# Altium project KeyPad_84_L.PrjPcb
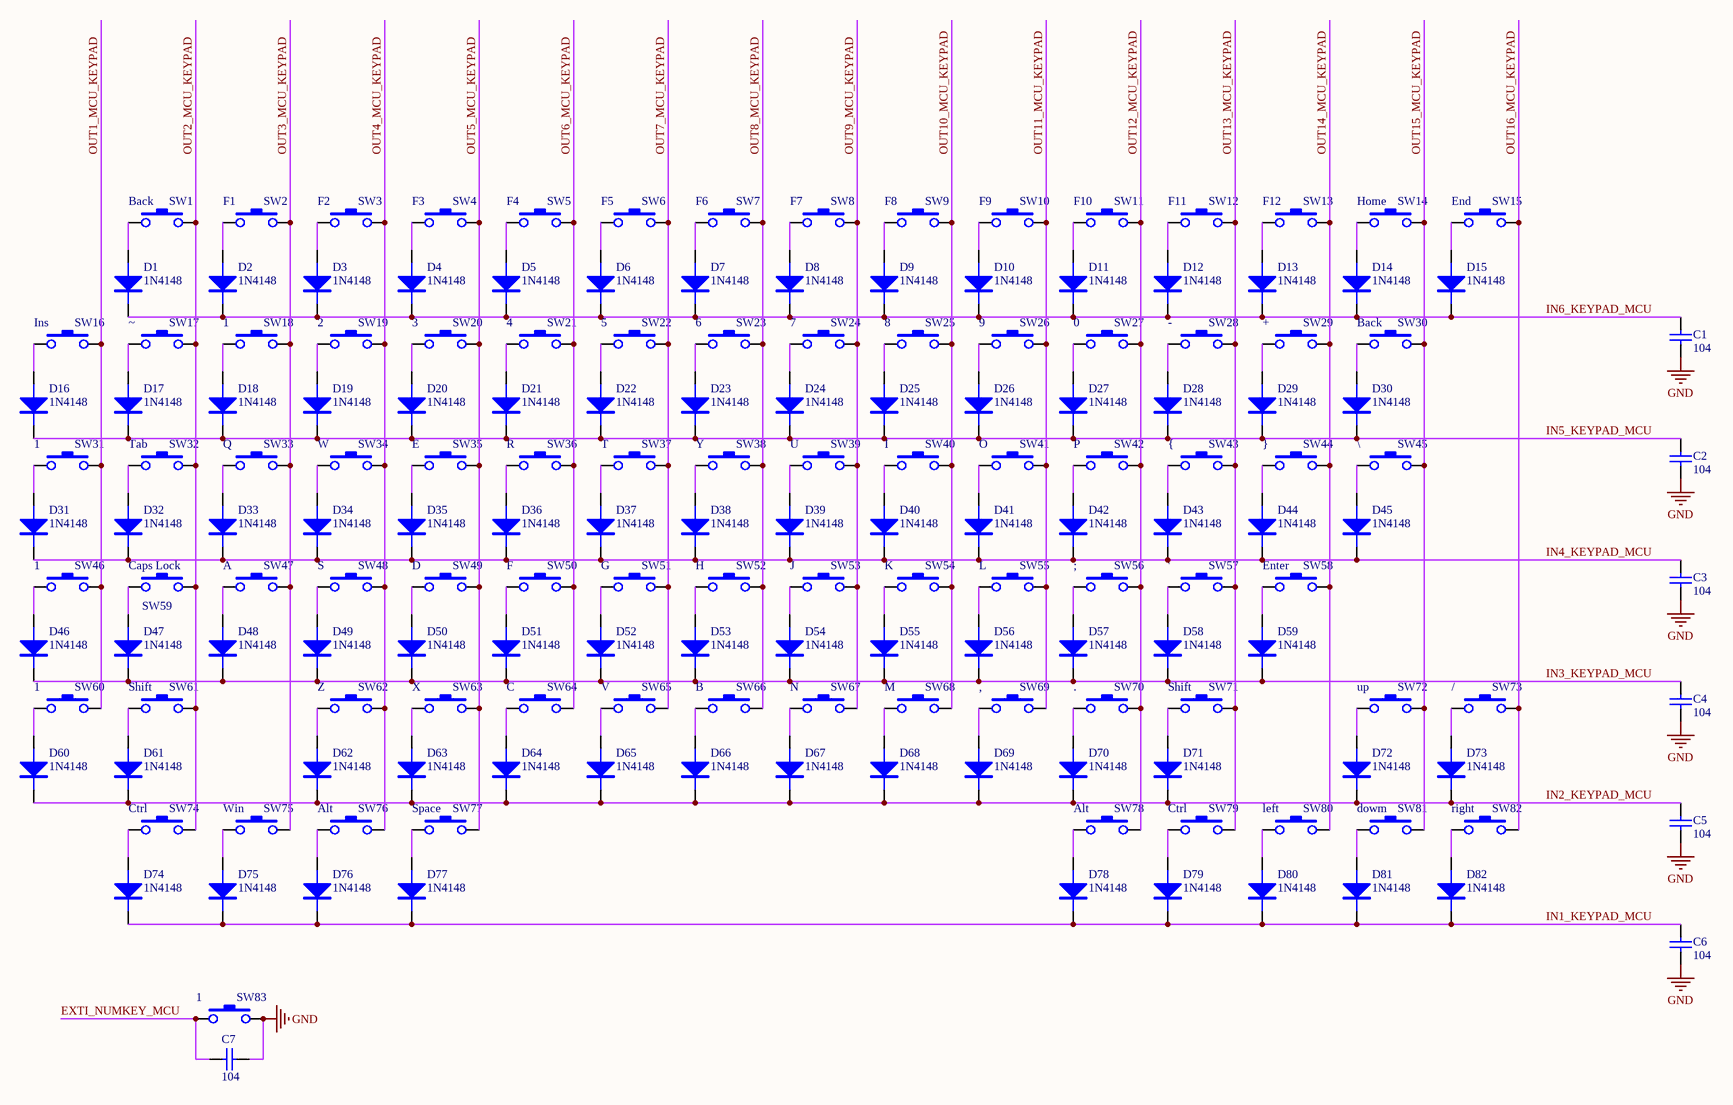
[diagram p0: KEY_Pad.SchDoc]
5 sheets, 237 parts. Net scope: global (net labels, ports and power ports of the same name join across sheets).
Board file: Keyboard_84.PcbDoc
Sheets:
  KEY_Pad.SchDoc
  POWER.SchDoc
  LED.SchDoc
  NRF24L01.SchDoc
  MCU.SchDoc

## Sheet KEY_Pad.SchDoc
size A3

### Parts
C1  104  [Cap-0603]
C2  104  [Cap-0603]
C3  104  [Cap-0603]
C4  104  [Cap-0603]
C5  104  [Cap-0603]
C6  104  [Cap-0603]
C7  104  [Cap-0603]
D1  1N4148  [SOD-523]
D2  1N4148  [SOD-523]
D3  1N4148  [SOD-523]
D4  1N4148  [SOD-523]
D5  1N4148  [SOD-523]
D6  1N4148  [SOD-523]
D7  1N4148  [SOD-523]
D8  1N4148  [SOD-523]
D9  1N4148  [SOD-523]
D10  1N4148  [SOD-523]
D11  1N4148  [SOD-523]
D12  1N4148  [SOD-523]
D13  1N4148  [SOD-523]
D14  1N4148  [SOD-523]
D15  1N4148  [SOD-523]
D16  1N4148  [SOD-523]
D17  1N4148  [SOD-523]
D18  1N4148  [SOD-523]
D19  1N4148  [SOD-523]
D20  1N4148  [SOD-523]
D21  1N4148  [SOD-523]
D22  1N4148  [SOD-523]
D23  1N4148  [SOD-523]
D24  1N4148  [SOD-523]
D25  1N4148  [SOD-523]
D26  1N4148  [SOD-523]
D27  1N4148  [SOD-523]
D28  1N4148  [SOD-523]
D29  1N4148  [SOD-523]
D30  1N4148  [SOD-523]
D31  1N4148  [SOD-523]
D32  1N4148  [SOD-523]
D33  1N4148  [SOD-523]
D34  1N4148  [SOD-523]
D35  1N4148  [SOD-523]
D36  1N4148  [SOD-523]
D37  1N4148  [SOD-523]
D38  1N4148  [SOD-523]
D39  1N4148  [SOD-523]
D40  1N4148  [SOD-523]
D41  1N4148  [SOD-523]
D42  1N4148  [SOD-523]
D43  1N4148  [SOD-523]
D44  1N4148  [SOD-523]
D45  1N4148  [SOD-523]
D46  1N4148  [SOD-523]
D47  1N4148  [SOD-523]
D48  1N4148  [SOD-523]
D49  1N4148  [SOD-523]
D50  1N4148  [SOD-523]
D51  1N4148  [SOD-523]
D52  1N4148  [SOD-523]
D53  1N4148  [SOD-523]
D54  1N4148  [SOD-523]
D55  1N4148  [SOD-523]
D56  1N4148  [SOD-523]
D57  1N4148  [SOD-523]
D58  1N4148  [SOD-523]
D59  1N4148  [SOD-523]
D60  1N4148  [SOD-523]
D61  1N4148  [SOD-523]
D62  1N4148  [SOD-523]
D63  1N4148  [SOD-523]
D64  1N4148  [SOD-523]
D65  1N4148  [SOD-523]
D66  1N4148  [SOD-523]
D67  1N4148  [SOD-523]
D68  1N4148  [SOD-523]
D69  1N4148  [SOD-523]
D70  1N4148  [SOD-523]
D71  1N4148  [SOD-523]
D72  1N4148  [SOD-523]
D73  1N4148  [SOD-523]
D74  1N4148  [SOD-523]
D75  1N4148  [SOD-523]
D76  1N4148  [SOD-523]
D77  1N4148  [SOD-523]
D78  1N4148  [SOD-523]
D79  1N4148  [SOD-523]
D80  1N4148  [SOD-523]
D81  1N4148  [SOD-523]
D82  1N4148  [SOD-523]
SW1  Back  [MX_SW-4]
SW2  F1  [MX_SW-4]
SW3  F2  [MX_SW-4]
SW4  F3  [MX_SW-4]
SW5  F4  [MX_SW-4]
SW6  F5  [MX_SW-4]
SW7  F6  [MX_SW-4]
SW8  F7  [MX_SW-4]
SW9  F8  [MX_SW-4]
SW10  F9  [MX_SW-4]
SW11  F10  [MX_SW-4]
SW12  F11  [MX_SW-4]
SW13  F12  [MX_SW-4]
SW14  Home  [MX_SW-4]
SW15  End  [MX_SW-4]
SW16  Ins  [MX_SW-4]
SW17  ~  [MX_SW-4]
SW18  1  [MX_SW-4]
SW19  2  [MX_SW-4]
SW20  3  [MX_SW-4]
SW21  4  [MX_SW-4]
SW22  5  [MX_SW-4]
SW23  6  [MX_SW-4]
SW24  7  [MX_SW-4]
SW25  8  [MX_SW-4]
SW26  9  [MX_SW-4]
SW27  0  [MX_SW-4]
SW28  -  [MX_SW-4]
SW29  +  [MX_SW-4]
SW30  Back  [MX_SW-4]
SW31  1  [MX_SW-4]
SW32  Tab  [MX_SW-4]
SW33  Q  [MX_SW-4]
SW34  W  [MX_SW-4]
SW35  E  [MX_SW-4]
SW36  R  [MX_SW-4]
SW37  T  [MX_SW-4]
SW38  Y  [MX_SW-4]
SW39  U  [MX_SW-4]
SW40  I  [MX_SW-4]
SW41  O  [MX_SW-4]
SW42  P  [MX_SW-4]
SW43  {  [MX_SW-4]
SW44  }  [MX_SW-4]
SW45  \  [MX_SW-4]
SW46  1  [MX_SW-4]
SW47  A  [MX_SW-4]
SW48  S  [MX_SW-4]
SW49  D  [MX_SW-4]
SW50  F  [MX_SW-4]
SW51  G  [MX_SW-4]
SW52  H  [MX_SW-4]
SW53  J  [MX_SW-4]
SW54  K  [MX_SW-4]
SW55  L  [MX_SW-4]
SW56  ;  [MX_SW-4]
SW57  '  [MX_SW-4]
SW58  Enter  [MX_SW-4]
SW59  Caps Lock  [MX_SW-4]
SW60  1  [MX_SW-4]
SW61  Shift  [MX_SW-4]
SW62  Z  [MX_SW-4]
SW63  X  [MX_SW-4]
SW64  C  [MX_SW-4]
SW65  V  [MX_SW-4]
SW66  B  [MX_SW-4]
SW67  N  [MX_SW-4]
SW68  M  [MX_SW-4]
SW69  ,  [MX_SW-4]
SW70  .  [MX_SW-4]
SW71  Shift  [MX_SW-4]
SW72  up  [MX_SW-4]
SW73  /  [MX_SW-4]
SW74  Ctrl  [MX_SW-4]
SW75  Win  [MX_SW-4]
SW76  Alt  [MX_SW-4]
SW77  Space  [MX_SW-4]
SW78  Alt  [MX_SW-4]
SW79  Ctrl  [MX_SW-4]
SW80  left  [MX_SW-4]
SW81  dowm  [MX_SW-4]
SW82  right  [MX_SW-4]
SW83  1  [MX_SW-4]

### Nets
GND: C1.2 C2.2 C3.2 C4.2 C5.2 C6.2 C7.2 SW83.2
EXTI_NUMKEY_MCU: C7.1 SW83.1
IN1_KEYPAD_MCU: C6.1 D74.K D75.K D76.K D77.K D78.K D79.K D80.K D81.K D82.K
IN2_KEYPAD_MCU: C5.1 D60.K D61.K D62.K D63.K D64.K D65.K D66.K D67.K D68.K D69.K D70.K D71.K D72.K D73.K
IN3_KEYPAD_MCU: C4.1 D46.K D47.K D48.K D49.K D50.K D51.K D52.K D53.K D54.K D55.K D56.K D57.K D58.K D59.K
IN4_KEYPAD_MCU: C3.1 D31.K D32.K D33.K D34.K D35.K D36.K D37.K D38.K D39.K D40.K D41.K D42.K D43.K D44.K D45.K
IN5_KEYPAD_MCU: C2.1 D16.K D17.K D18.K D19.K D20.K D21.K D22.K D23.K D24.K D25.K D26.K D27.K D28.K D29.K D30.K
IN6_KEYPAD_MCU: C1.1 D1.K D2.K D3.K D4.K D5.K D6.K D7.K D8.K D9.K D10.K D11.K D12.K D13.K D14.K D15.K
OUT1_MCU_KEYPAD: SW16.2 SW31.2 SW46.2 SW60.2
OUT2_MCU_KEYPAD: SW1.2 SW17.2 SW32.2 SW59.2 SW61.2 SW74.2
OUT3_MCU_KEYPAD: SW2.2 SW18.2 SW33.2 SW47.2 SW75.2
OUT4_MCU_KEYPAD: SW3.2 SW19.2 SW34.2 SW48.2 SW62.2 SW76.2
OUT5_MCU_KEYPAD: SW4.2 SW20.2 SW35.2 SW49.2 SW63.2 SW77.2
OUT6_MCU_KEYPAD: SW5.2 SW21.2 SW36.2 SW50.2 SW64.2
OUT7_MCU_KEYPAD: SW6.2 SW22.2 SW37.2 SW51.2 SW65.2
OUT8_MCU_KEYPAD: SW7.2 SW23.2 SW38.2 SW52.2 SW66.2
OUT9_MCU_KEYPAD: SW8.2 SW24.2 SW39.2 SW53.2 SW67.2
OUT10_MCU_KEYPAD: SW9.2 SW25.2 SW40.2 SW54.2 SW68.2
OUT11_MCU_KEYPAD: SW10.2 SW26.2 SW41.2 SW55.2 SW69.2
OUT12_MCU_KEYPAD: SW11.2 SW27.2 SW42.2 SW56.2 SW70.2 SW78.2
OUT13_MCU_KEYPAD: SW12.2 SW28.2 SW43.2 SW57.2 SW71.2 SW79.2
OUT14_MCU_KEYPAD: SW13.2 SW29.2 SW44.2 SW58.2 SW80.2
OUT15_MCU_KEYPAD: SW14.2 SW30.2 SW45.2 SW72.2 SW81.2
OUT16_MCU_KEYPAD: SW15.2 SW73.2 SW82.2
NetD1_A: D1.A SW1.1
NetD2_A: D2.A SW2.1
NetD3_A: D3.A SW3.1
NetD4_A: D4.A SW4.1
NetD5_A: D5.A SW5.1
NetD6_A: D6.A SW6.1
NetD7_A: D7.A SW7.1
NetD8_A: D8.A SW8.1
NetD9_A: D9.A SW9.1
NetD10_A: D10.A SW10.1
NetD11_A: D11.A SW11.1
NetD12_A: D12.A SW12.1
NetD13_A: D13.A SW13.1
NetD14_A: D14.A SW14.1
NetD15_A: D15.A SW15.1
NetD16_A: D16.A SW16.1
NetD17_A: D17.A SW17.1
NetD18_A: D18.A SW18.1
NetD19_A: D19.A SW19.1
NetD20_A: D20.A SW20.1
NetD21_A: D21.A SW21.1
NetD22_A: D22.A SW22.1
NetD23_A: D23.A SW23.1
NetD24_A: D24.A SW24.1
NetD25_A: D25.A SW25.1
NetD26_A: D26.A SW26.1
NetD27_A: D27.A SW27.1
NetD28_A: D28.A SW28.1
NetD29_A: D29.A SW29.1
NetD30_A: D30.A SW30.1
NetD31_A: D31.A SW31.1
NetD32_A: D32.A SW32.1
NetD33_A: D33.A SW33.1
NetD34_A: D34.A SW34.1
NetD35_A: D35.A SW35.1
NetD36_A: D36.A SW36.1
NetD37_A: D37.A SW37.1
NetD38_A: D38.A SW38.1
NetD39_A: D39.A SW39.1
NetD40_A: D40.A SW40.1
NetD41_A: D41.A SW41.1
NetD42_A: D42.A SW42.1
NetD43_A: D43.A SW43.1
NetD44_A: D44.A SW44.1
NetD45_A: D45.A SW45.1
NetD46_A: D46.A SW46.1
NetD47_A: D47.A SW59.1
NetD48_A: D48.A SW47.1
NetD49_A: D49.A SW48.1
NetD50_A: D50.A SW49.1
NetD51_A: D51.A SW50.1
NetD52_A: D52.A SW51.1
NetD53_A: D53.A SW52.1
NetD54_A: D54.A SW53.1
NetD55_A: D55.A SW54.1
NetD56_A: D56.A SW55.1
NetD57_A: D57.A SW56.1
NetD58_A: D58.A SW57.1
NetD59_A: D59.A SW58.1
NetD60_A: D60.A SW60.1
NetD61_A: D61.A SW61.1
NetD62_A: D62.A SW62.1
NetD63_A: D63.A SW63.1
NetD64_A: D64.A SW64.1
NetD65_A: D65.A SW65.1
NetD66_A: D66.A SW66.1
NetD67_A: D67.A SW67.1
NetD68_A: D68.A SW68.1
NetD69_A: D69.A SW69.1
NetD70_A: D70.A SW70.1
NetD71_A: D71.A SW71.1
NetD72_A: D72.A SW72.1
NetD73_A: D73.A SW73.1
NetD74_A: D74.A SW74.1
NetD75_A: D75.A SW75.1
NetD76_A: D76.A SW76.1
NetD77_A: D77.A SW77.1
NetD78_A: D78.A SW78.1
NetD79_A: D79.A SW79.1
NetD80_A: D80.A SW80.1
NetD81_A: D81.A SW81.1
NetD82_A: D82.A SW82.1

### Notes on the sheet
- Title
- Size:
- Date:
- A3
- Number:
- Time:
- Revision:
- Sheet
- of
- File:

### Library data of the parts
C1-C7 = CAP: 贴片陶瓷电容
D1-D82 = DIODE: 普通二极管
SW1-SW83 = MX_SW-4: with Fixation pins  1-Pole

## Sheet POWER.SchDoc
size A4
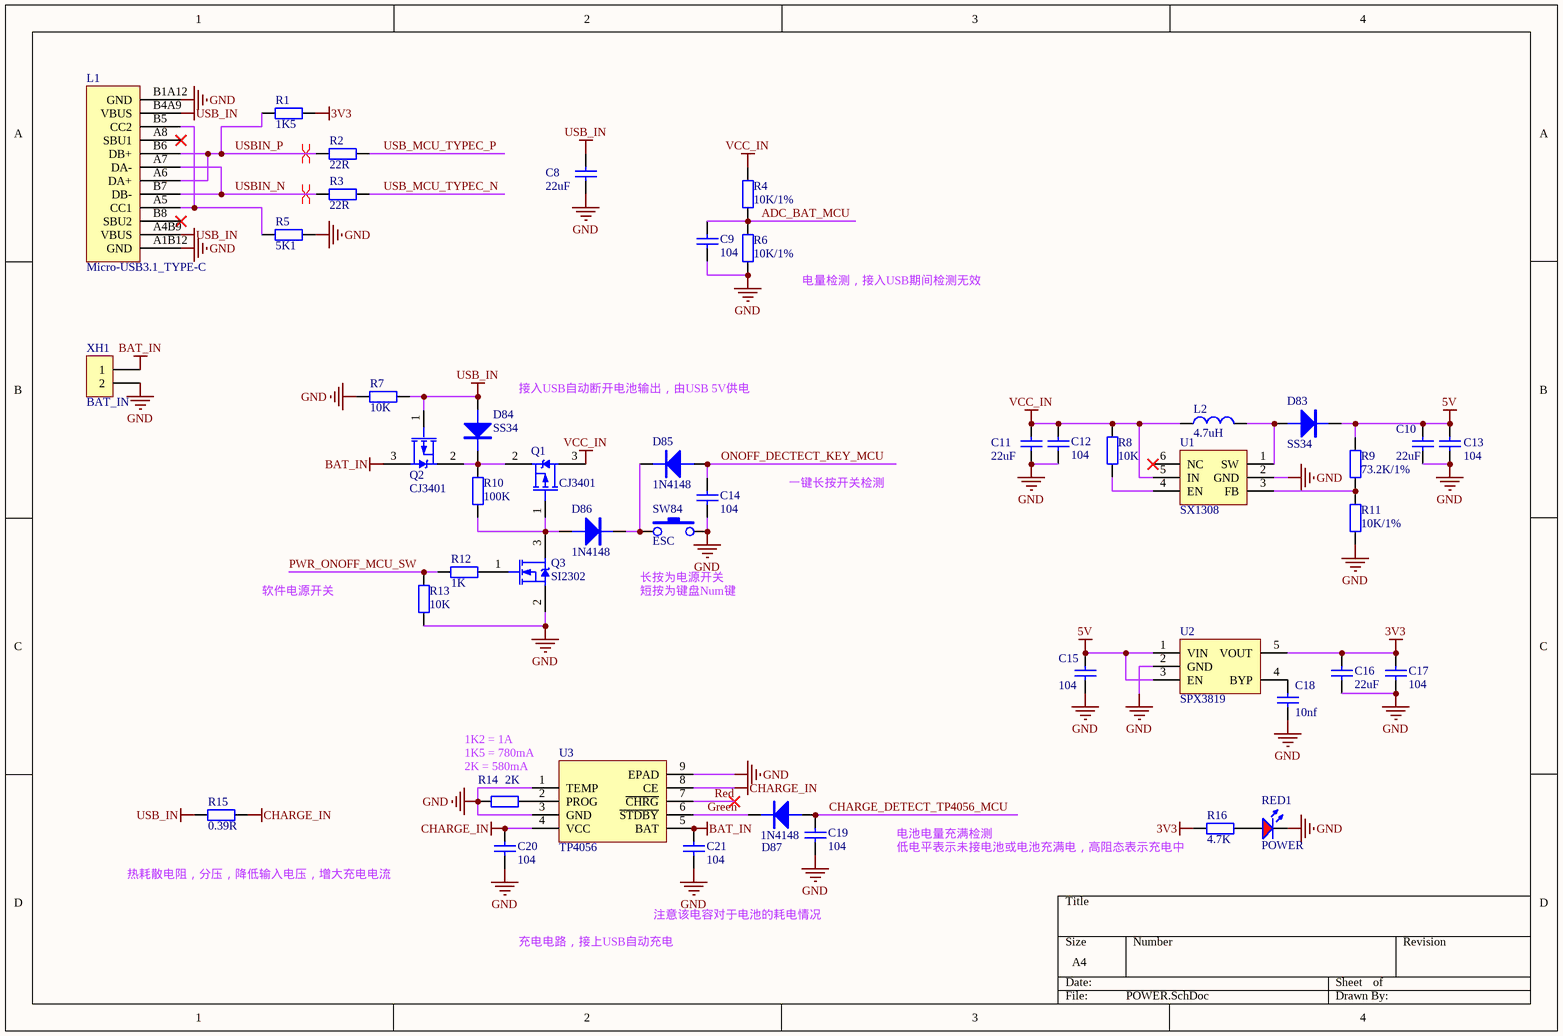
[diagram p1: POWER.SchDoc]

### Parts
C8  22uF  [Cap-0805]
C9  104  [Cap-0603]
C10  22uF  [Cap-0805]
C11  22uF  [Cap-0805]
C12  104  [Cap-0603]
C13  104  [Cap-0603]
C14  104  [Cap-0603]
C15  104  [Cap-0603]
C16  22uF  [Cap-0805]
C17  104  [Cap-0603]
C18  10nf  [Cap-0603]
C19  104  [Cap-0603]
C20  104  [Cap-0603]
C21  104  [Cap-0603]
D83  SS34  [Doide-SMA]
D84  SS34  [Doide-SMA]
D85  1N4148  [SOD-523]
D86  1N4148  [SOD-523]
D87  1N4148  [SOD-523]
L1  Micro-USB3.1_TYPE-C  [USB3.0-TYPEC-12P]
L2  4.7uH  [L-MHC0603]
Q1  CJ3401  [SOT23-3]
Q2  CJ3401  [SOT23-3]
Q3  SI2302  [SOT23-3]
R1  1K5  [Res-0603]
R2  22R  [Res-0603]
R3  22R  [Res-0603]
R4  10K/1%  [Res-0603]
R5  5K1  [Res-0603]
R6  10K/1%  [Res-0603]
R7  10K  [Res-0603]
R8  10K  [Res-0603]
R9  73.2K/1%  [Res-0603]
R10  100K  [Res-0603]
R11  10K/1%  [Res-0603]
R12  1K  [Res-0603]
R13  10K  [Res-0603]
R14  2K  [Res-0603]
R15  0.39R  [Res-1812]
R16  4.7K  [Res-0603]
RED1  POWER  [LED_0603_R]
SW84  ESC  [MX_SW-4]
U1  SX1308  [SX1308]
U2  SPX3819  [SOT23-5]
U3  TP4056  [TP4056]
XH1  BAT_IN  [XH2/2.54mm/180]

### Nets
3V3: C16.2 C17.1 R1.1 R16.2 U2.5(VOUT)
5V: C10.2 C13.2 C15.2 D83.K R9.2 U2.1(VIN) U2.3(EN)
BAT_IN: C21.2 Q2.3(D) U3.5(BAT) XH1.1
CHARGE_IN: C20.2 R15.2 U3.4(VCC) U3.8(CE)
GND: C8.1 C9.1 C10.1 C11.1 C12.1 C13.1 C14.2 C15.1 C16.1 C17.2 C18.1 C19.1 C20.1 C21.1 L1.A1B12(GND) L1.B1A12(GND) Q3.2(S) R5.1 R6.1 R7.2 R11.1 R13.2 R14.2 RED1.2(K) SW84.2 U1.2(GND) U2.2(GND) U3.1(TEMP) U3.3(GND) U3.9(EPAD) XH1.2
USB_IN: C8.2 D84.A L1.A4B9(VBUS) L1.B4A9(VBUS) Q2.1(G) R7.1 R15.1
VCC_IN: C11.2 C12.2 L2.2 Q1.3(D) R4.2 R8.1 U1.5(IN)
ADC_BAT_MCU: C9.2 R4.1 R6.2
CHARGE_DETECT_TP4056_MCU: C19.2 D87.A
Green: D87.K U3.6(~{STDBY})
ONOFF_DECTECT_KEY_MCU: C14.1 D85.A
PWR_ONOFF_MCU_SW: R12.1 R13.1
Red: U3.7(~{CHRG})
USB_MCU_TYPEC_N: R3.1
USB_MCU_TYPEC_P: R2.1
USBIN_N: L1.A7(DA-) L1.B7(DB-) R3.2
USBIN_P: L1.A6(DA+) L1.B6(DB+) R1.2 R2.2
NetC18_2: C18.2 U2.4(BYP)
NetD83_A: D83.A L2.1 U1.1(SW)
NetD84_K: D84.K Q1.2(S) Q2.2(S) R10.1
NetD85_K: D85.K D86.K SW84.1
NetD86_A: D86.A Q1.1(G) Q3.3(D) R10.2
NetL1_A5: L1.A5(CC1) L1.B5(CC2) R5.2
NetQ3_1: Q3.1(G) R12.2
NetR8_2: R8.2 U1.4(EN)
NetR9_1: R9.1 R11.2 U1.3(FB)
NetR14_1: R14.1 U3.2(PROG)
NetR16_1: R16.1 RED1.1(A)

Not connected (* = marked no-connect by the designer): L1 A8(SBU1)* B8(SBU2)*; U1 6(NC)*

### Layout directives
differential pair: USBIN_N, USBIN_P

### Notes on the sheet
- 电量检测，接入USB期间检测无效
- 接入USB自动断开电池输出，由USB 5V供电
- 一键长按开关检测
- 长按为电源开关
- 软件电源开关
- 短按为键盘Num键
- 1K2 = 1A
- 1K5 = 780mA
- 2K = 580mA
- 电池电量充满检测
- 低电平表示未接电池或电池充满电，高阻态表示充电中
- 热耗散电阻，分压，降低输入电压，增大充电电流
- 注意该电容对于电池的耗电情况
- 充电电路，接上USB自动充电

### Library data of the parts
C8-C17 C19-C21 = CAP: 贴片陶瓷电容
C18 = Cap
D83-D87 = DIODE: 普通二极管
L2 = INDUCTOR-SMD: 贴片屏蔽电感
Q1 Q2 = MOSFET-P2: P-Channel MOSFET; PackageDocument: 1995/1996; Published: 8-Jun-2000; LatestRevisionDate: 17-Jul-2002; LatestRevisionNote: Re-released for DXP Platform.; PackageReference: E3; Publisher: Altium Limited
Q3 = MOSFET-N2: N-Channel MOSFET; PackageDocument: 1995/1996; Published: 8-Jun-2000; LatestRevisionDate: 17-Jul-2002; LatestRevisionNote: Re-released for DXP Platform.; PackageReference: E3; Publisher: Altium Limited
R1-R16 = RES: 贴片电阻
RED1 = LED_SMD_RED: 发光二极管; ComponentLink1Description: 供应商链接; ComponentLink1URL: http://www.szlcsc.com/product/details_2659.html; Package: 0603; Supplier: LC; SuppliersPartNumber: C2286
SW84 = MX_SW-4: with Fixation pins  1-Pole
XH1 = XH2

## Sheet LED.SchDoc
size A4
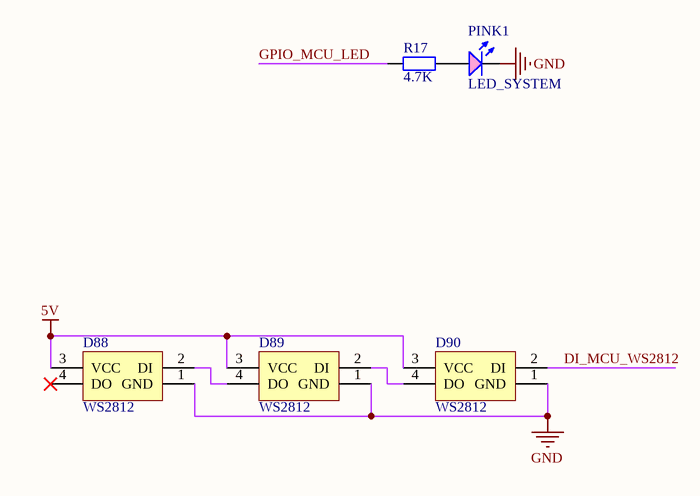
[diagram p2: LED.SchDoc]

### Parts
D88  WS2812  [RGB_LED_1206]
D89  WS2812  [RGB_LED_1206]
D90  WS2812  [RGB_LED_1206]
PINK1  LED_SYSTEM  [LED_0603_R]
R17  4.7K  [Res-0603]

### Nets
5V: D88.3(VCC) D89.3(VCC) D90.3(VCC)
GND: D88.1(GND) D89.1(GND) D90.1(GND) PINK1.2(K)
DI_MCU_WS2812: D90.2(DI)
GPIO_MCU_LED: R17.2
NetD88_2: D88.2(DI) D89.4(DO)
NetD89_2: D89.2(DI) D90.4(DO)
NetPINK1_1: PINK1.1(A) R17.1

Not connected (* = marked no-connect by the designer): D88 4(DO)*

### Notes on the sheet
- Title
- Size:
- Date:
- A4
- Number:
- Time:
- Revision:
- Sheet
- of
- File:

### Library data of the parts
PINK1 = LED_SMD_PINK: 发光二极管; ComponentLink1Description: 供应商链接; ComponentLink1URL: http://www.szlcsc.com/product/details_2659.html; Package: 0603; Supplier: LC; SuppliersPartNumber: C2286
R17 = RES: 贴片电阻
D88-D90 = WS2812: Publisher: mazhongwei; Published: 8-August-2017; PackageReference: RGB_LED_5050

## Sheet NRF24L01.SchDoc
size A4; Organization: Altium Limited; Address1: L3, 12a Rodborough Rd; Address2: Frenchs Forest; Address3: NSW; Address4: Australia 2086
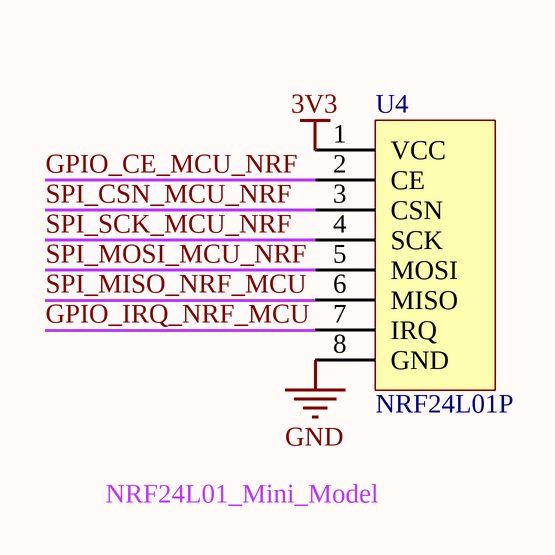
[diagram p3: NRF24L01.SchDoc]

### Parts
U4  NRF24L01P  [NRF24L01P]

### Nets
3V3: U4.1(VCC)
GND: U4.8(GND)
GPIO_CE_MCU_NRF: U4.2(CE)
GPIO_IRQ_NRF_MCU: U4.7(IRQ)
SPI_CSN_MCU_NRF: U4.3(CSN)
SPI_MISO_NRF_MCU: U4.6(MISO)
SPI_MOSI_MCU_NRF: U4.5(MOSI)
SPI_SCK_MCU_NRF: U4.4(SCK)

### Notes on the sheet
- NRF24L01_Mini_Model
- Title
- Size:
- Date:
- A4
- Number:
- Time:
- Revision:
- Sheet
- of
- File:

### Library data of the parts
U4 = NRF24L01P: 2.4G无线模块

## Sheet MCU.SchDoc
size A4
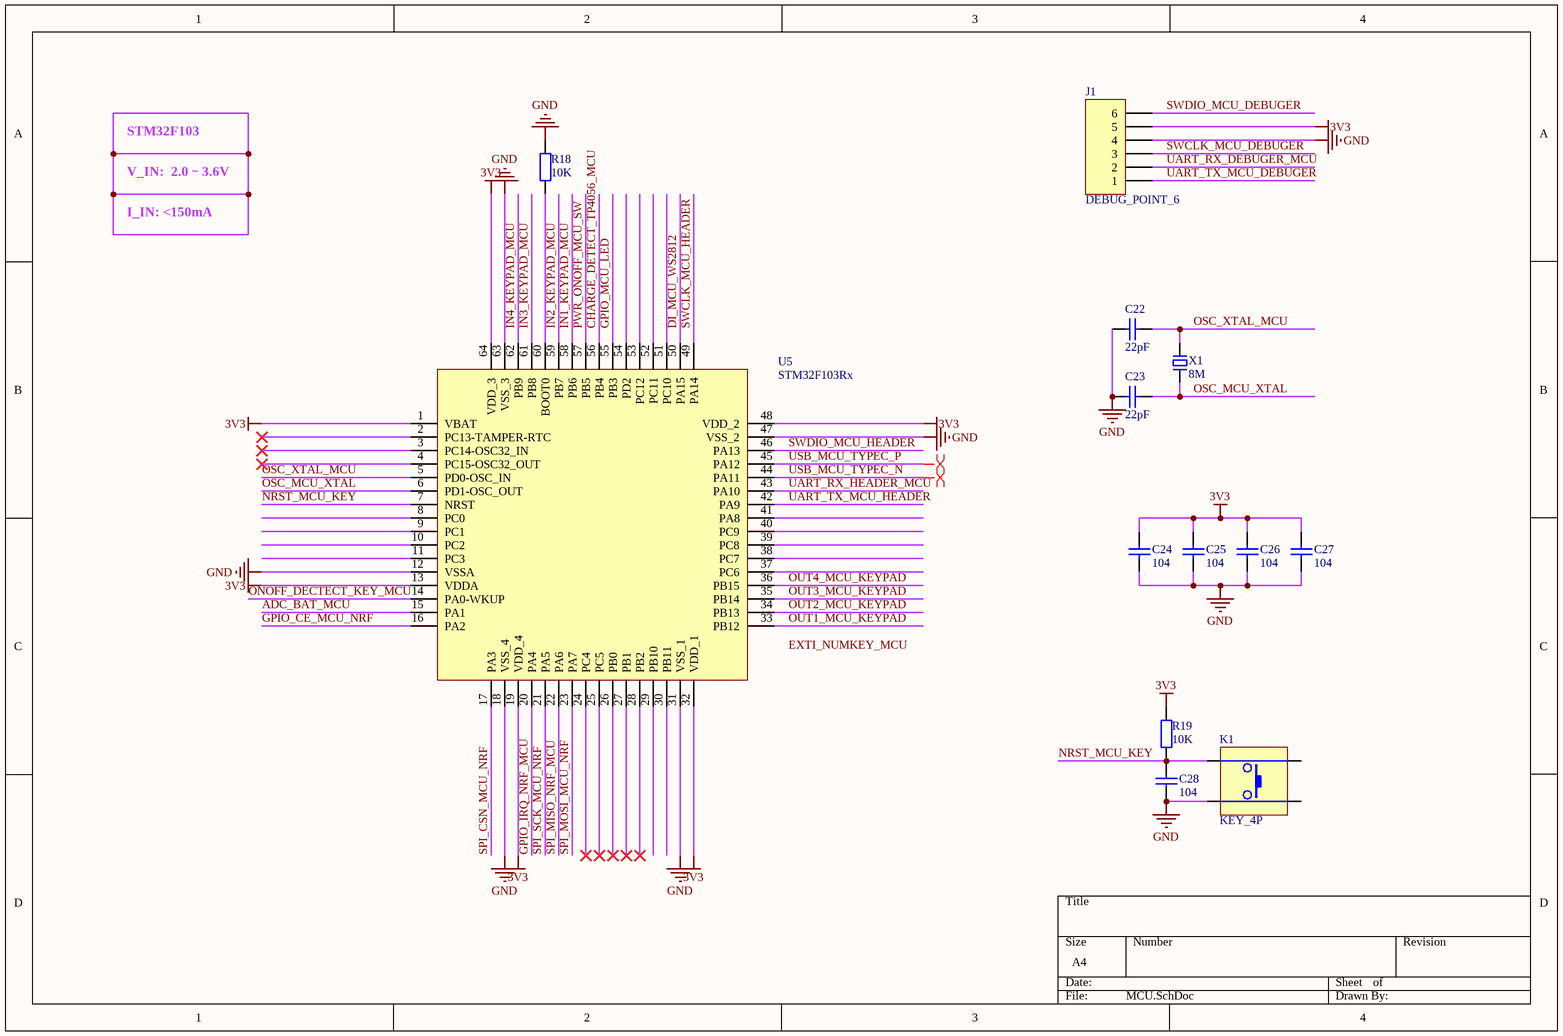
[diagram p4: MCU.SchDoc]

### Parts
C22  22pF  [Cap-0603]
C23  22pF  [Cap-0603]
C24  104  [Cap-0603]
C25  104  [Cap-0603]
C26  104  [Cap-0603]
C27  104  [Cap-0603]
C28  104  [Cap-0603]
J1  DEBUG_POINT_6  [DEBUG_POINT_6]
K1  KEY_4P  [SW-SMD-3X4X2.5]
R18  10K  [Res-0603]
R19  10K  [Res-0603]
U5  STM32F103Rx  [STM-LQFP64_N]
X1  8M  [OSC 5032-2P]

### Nets
3V3: C24.2 C25.2 C26.2 C27.2 J1.5 R19.2 U5.1(VBAT) U5.13(VDDA) U5.19(VDD_4) U5.32(VDD_1) U5.48(VDD_2) U5.64(VDD_3)
GND: C22.1 C23.1 C24.1 C25.1 C26.1 C27.1 C28.1 J1.4 K1.4 R18.2 U5.12(VSSA) U5.18(VSS_4) U5.31(VSS_1) U5.47(VSS_2) U5.63(VSS_3)
ADC_BAT_MCU: U5.15(PA1)
CHARGE_DETECT_TP4056_MCU: U5.56(PB4)
DI_MCU_WS2812: U5.50(PA15)
GPIO_CE_MCU_NRF: U5.16(PA2)
GPIO_IRQ_NRF_MCU: U5.20(PA4)
GPIO_MCU_LED: U5.55(PB3)
IN1_KEYPAD_MCU: U5.58(PB6)
IN2_KEYPAD_MCU: U5.59(PB7)
IN3_KEYPAD_MCU: U5.61(PB8)
IN4_KEYPAD_MCU: U5.62(PB9)
NRST_MCU_KEY: C28.2 K1.3 R19.1 U5.7(NRST)
ONOFF_DECTECT_KEY_MCU: U5.14(PA0-WKUP)
OSC_MCU_XTAL: C23.2 U5.6(PD1-OSC_OUT) X1.1
OSC_XTAL_MCU: C22.2 U5.5(PD0-OSC_IN) X1.2
OUT1_MCU_KEYPAD: U5.33(PB12)
OUT2_MCU_KEYPAD: U5.34(PB13)
OUT3_MCU_KEYPAD: U5.35(PB14)
OUT4_MCU_KEYPAD: U5.36(PB15)
PWR_ONOFF_MCU_SW: U5.57(PB5)
SPI_CSN_MCU_NRF: U5.17(PA3)
SPI_MISO_NRF_MCU: U5.22(PA6)
SPI_MOSI_MCU_NRF: U5.23(PA7)
SPI_SCK_MCU_NRF: U5.21(PA5)
SWCLK_MCU_DEBUGER: J1.3
SWCLK_MCU_HEADER: U5.49(PA14)
SWDIO_MCU_DEBUGER: J1.6
SWDIO_MCU_HEADER: U5.46(PA13)
UART_RX_DEBUGER_MCU: J1.2
UART_RX_HEADER_MCU: U5.43(PA10)
UART_TX_MCU_DEBUGER: J1.1
UART_TX_MCU_HEADER: U5.42(PA9)
USB_MCU_TYPEC_N: U5.44(PA11)
USB_MCU_TYPEC_P: U5.45(PA12)
NetR18_1: R18.1 U5.60(BOOT0)

Not connected (* = marked no-connect by the designer): K1 1 2; U5 2(PC13-TAMPER-RTC)* 3(PC14-OSC32_IN)* 4(PC15-OSC32_OUT)* 8(PC0) 9(PC1) 10(PC2) 11(PC3) 24(PC4)* 25(PC5)* 26(PB0)* 27(PB1)* 28(PB2)* 29(PB10) 30(PB11) 37(PC6) 38(PC7) 39(PC8) 40(PC9) 41(PA8) 51(PC10) 52(PC11) 53(PC12) 54(PD2)

### Layout directives
differential pair: USB_MCU_TYPEC_N, USB_MCU_TYPEC_P

### Notes on the sheet
- STM32F103
- V_IN:  2.0～3.6V
- I_IN: <150mA
- Labels drawn without touching a wire or pin: EXTI_NUMKEY_MCU

### Library data of the parts
C22-C28 = CAP: 贴片陶瓷电容
R18 R19 = RES: 贴片电阻
X1 = XTAL-2P: 2脚无源脚晶振

## Nets that join several sheets
3V3: POWER (5 pins), NRF24L01 (U4.1), MCU (12 pins)
5V: POWER (7 pins), LED (D88.3 D89.3 D90.3)
GND: KEY_Pad (8 pins), POWER (31 pins), LED (D88.1 D89.1 D90.1 PINK1.2), NRF24L01 (U4.8), MCU (15 pins)
ADC_BAT_MCU: POWER (C9.2 R4.1 R6.2), MCU (U5.15)
CHARGE_DETECT_TP4056_MCU: POWER (C19.2 D87.A), MCU (U5.56)
DI_MCU_WS2812: LED (D90.2), MCU (U5.50)
GPIO_CE_MCU_NRF: NRF24L01 (U4.2), MCU (U5.16)
GPIO_IRQ_NRF_MCU: NRF24L01 (U4.7), MCU (U5.20)
GPIO_MCU_LED: LED (R17.2), MCU (U5.55)
IN1_KEYPAD_MCU: KEY_Pad (10 pins), MCU (U5.58)
IN2_KEYPAD_MCU: KEY_Pad (15 pins), MCU (U5.59)
IN3_KEYPAD_MCU: KEY_Pad (15 pins), MCU (U5.61)
IN4_KEYPAD_MCU: KEY_Pad (16 pins), MCU (U5.62)
ONOFF_DECTECT_KEY_MCU: POWER (C14.1 D85.A), MCU (U5.14)
OUT1_MCU_KEYPAD: KEY_Pad (SW16.2 SW31.2 SW46.2 SW60.2), MCU (U5.33)
OUT2_MCU_KEYPAD: KEY_Pad (6 pins), MCU (U5.34)
OUT3_MCU_KEYPAD: KEY_Pad (5 pins), MCU (U5.35)
OUT4_MCU_KEYPAD: KEY_Pad (6 pins), MCU (U5.36)
PWR_ONOFF_MCU_SW: POWER (R12.1 R13.1), MCU (U5.57)
SPI_CSN_MCU_NRF: NRF24L01 (U4.3), MCU (U5.17)
SPI_MISO_NRF_MCU: NRF24L01 (U4.6), MCU (U5.22)
SPI_MOSI_MCU_NRF: NRF24L01 (U4.5), MCU (U5.23)
SPI_SCK_MCU_NRF: NRF24L01 (U4.4), MCU (U5.21)
USB_MCU_TYPEC_N: POWER (R3.1), MCU (U5.44)
USB_MCU_TYPEC_P: POWER (R2.1), MCU (U5.45)